# Altium schematic sheet HeartLED.SchDoc
size 889 x 381 mm; SheetNumber: 1; SheetTotal: 1
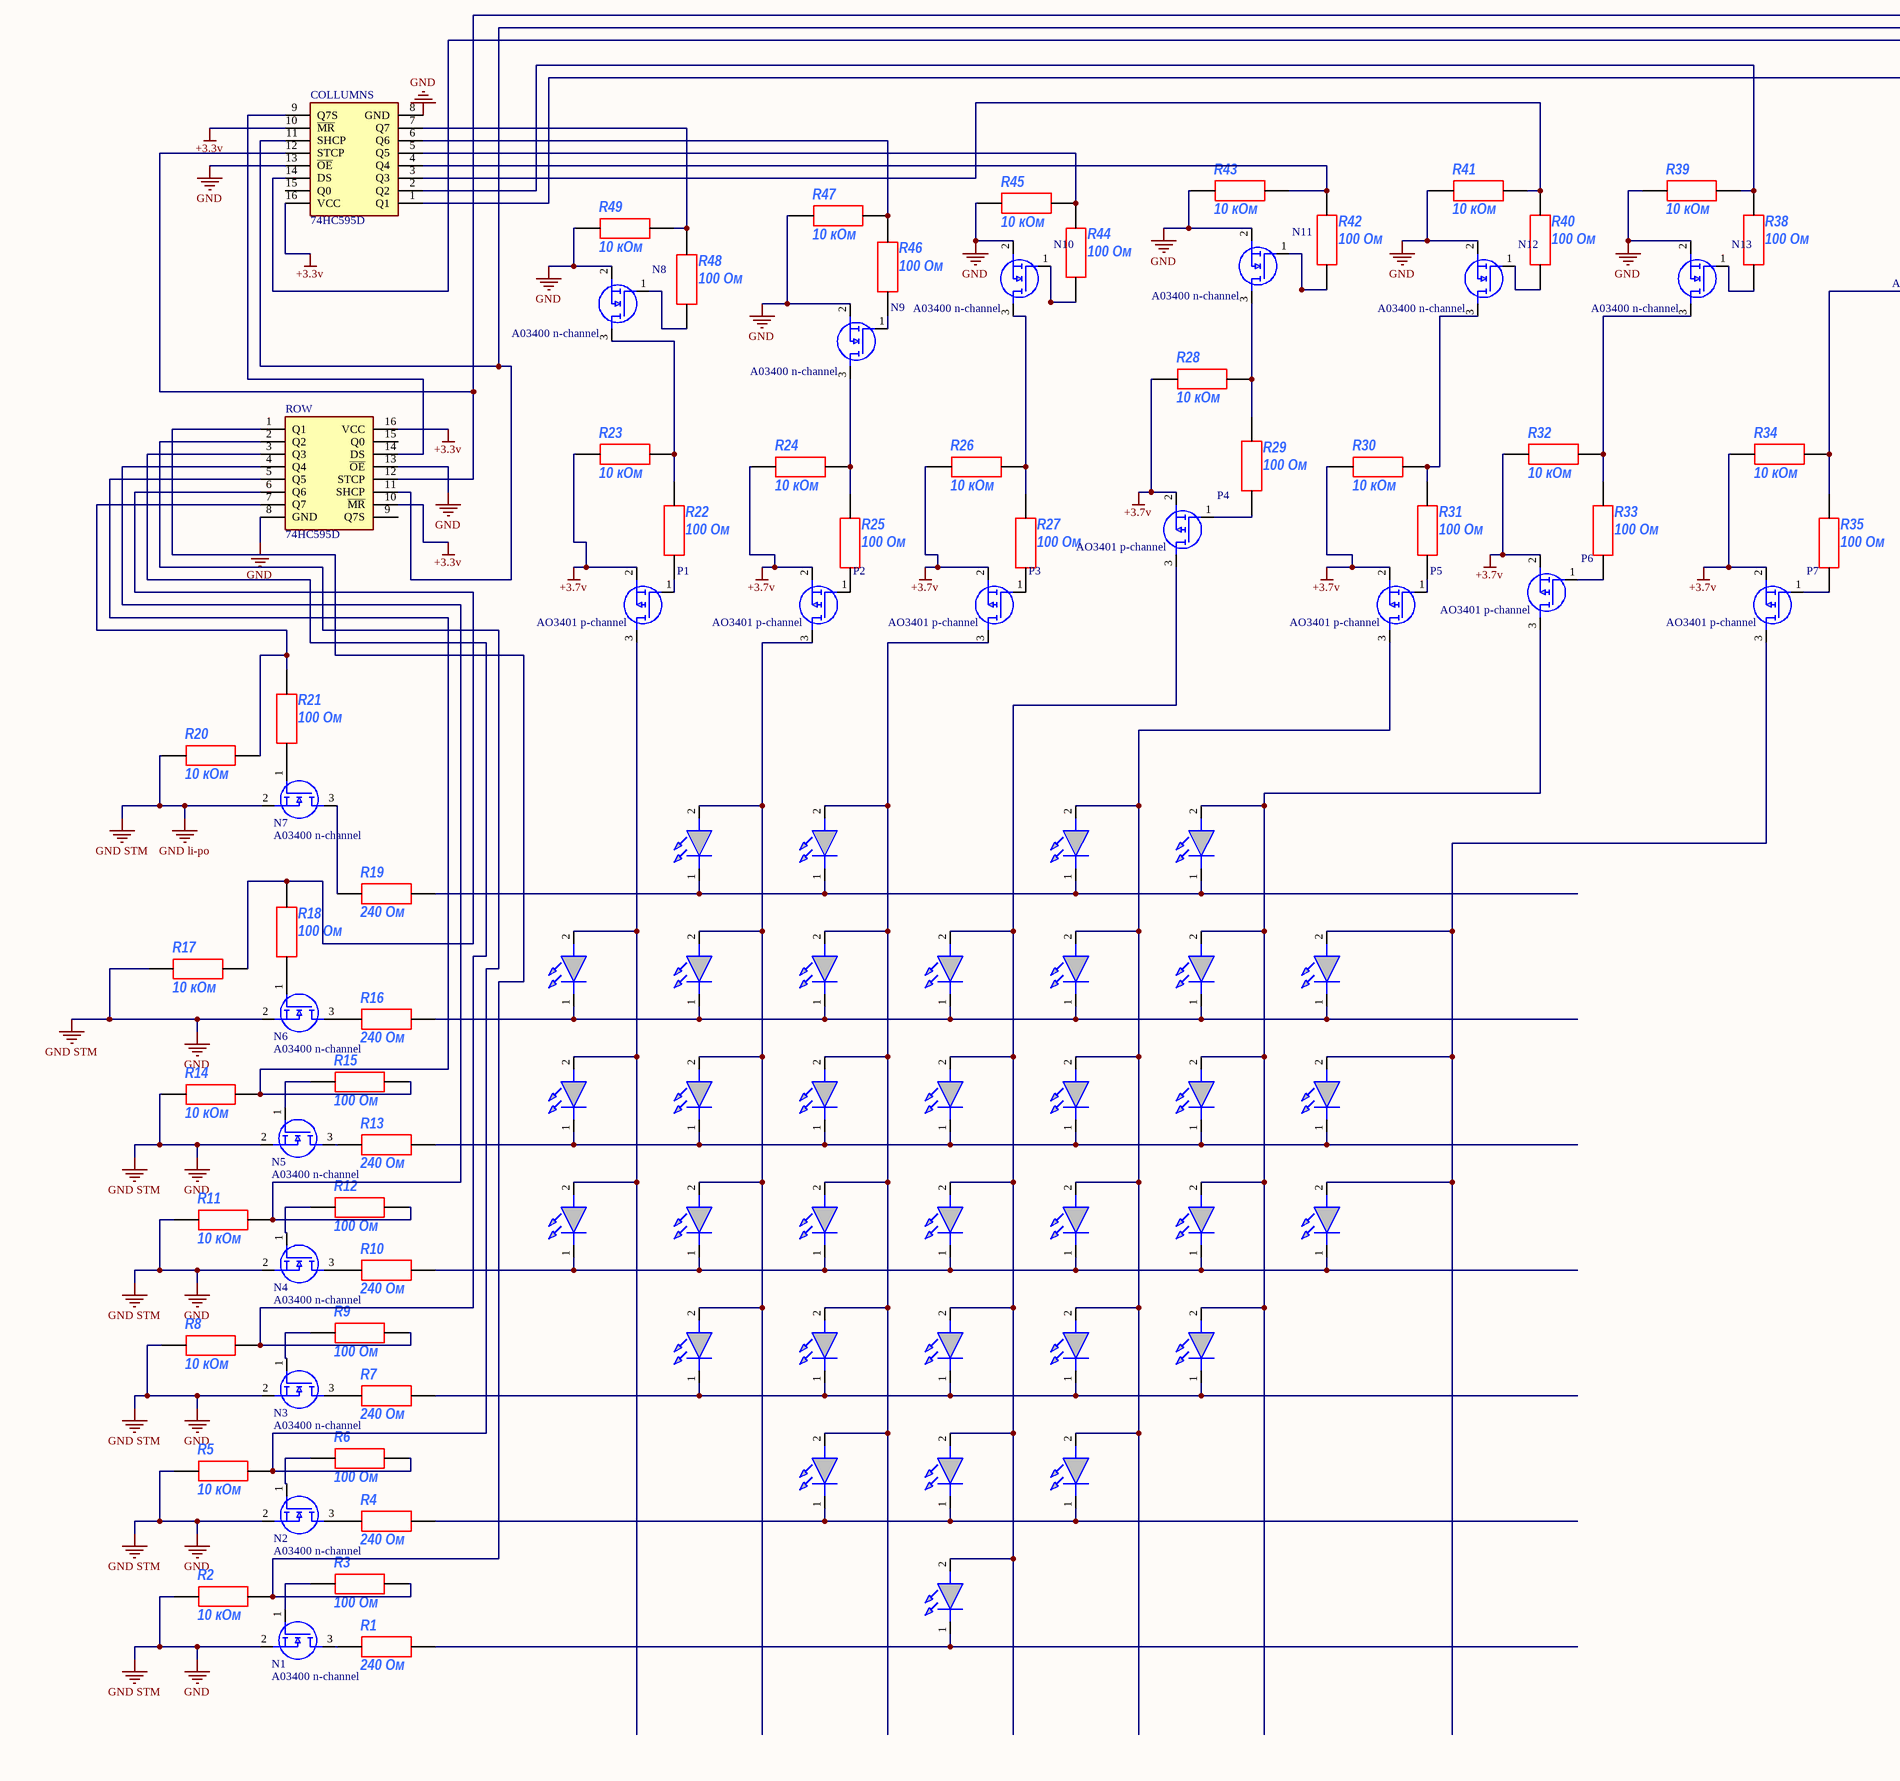
[diagram p0: HeartLED.SchDoc, left]
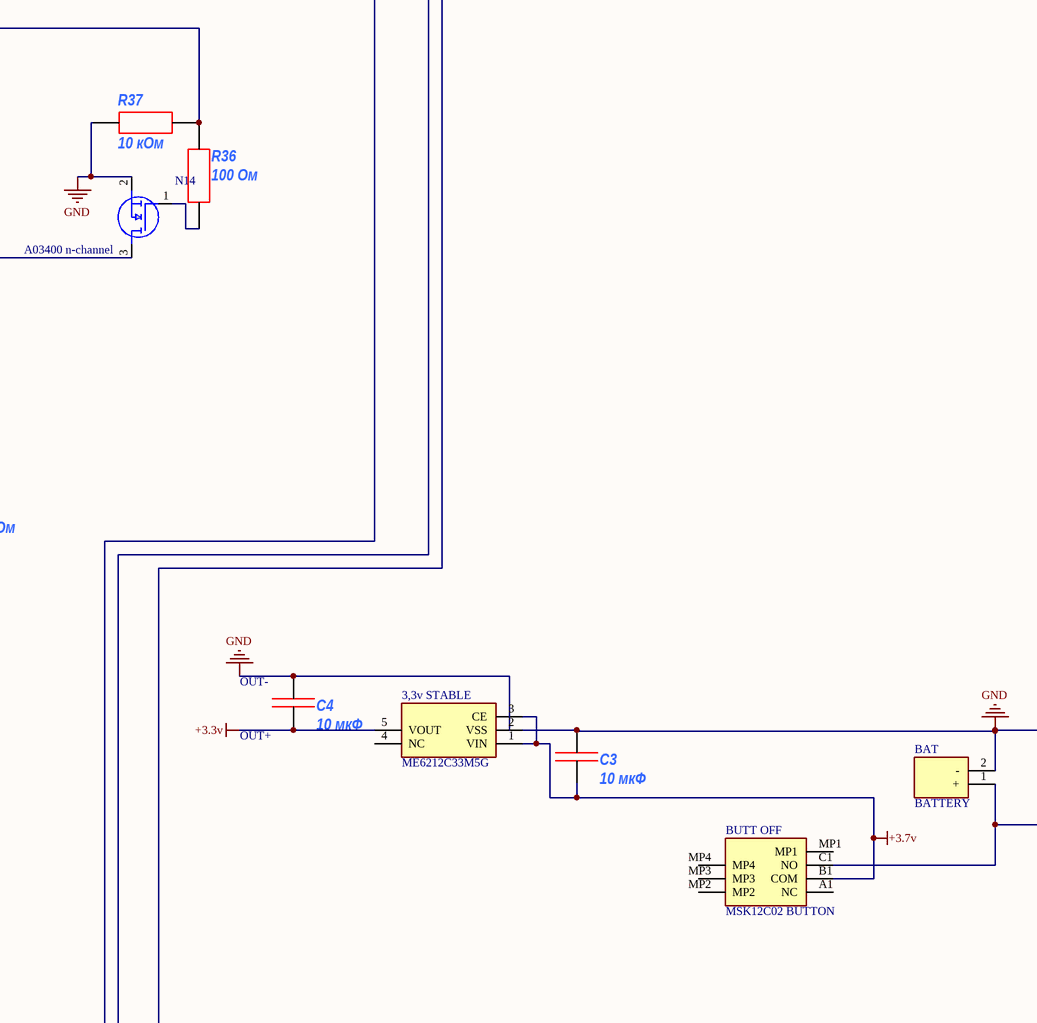
[diagram p1: HeartLED.SchDoc, middle]
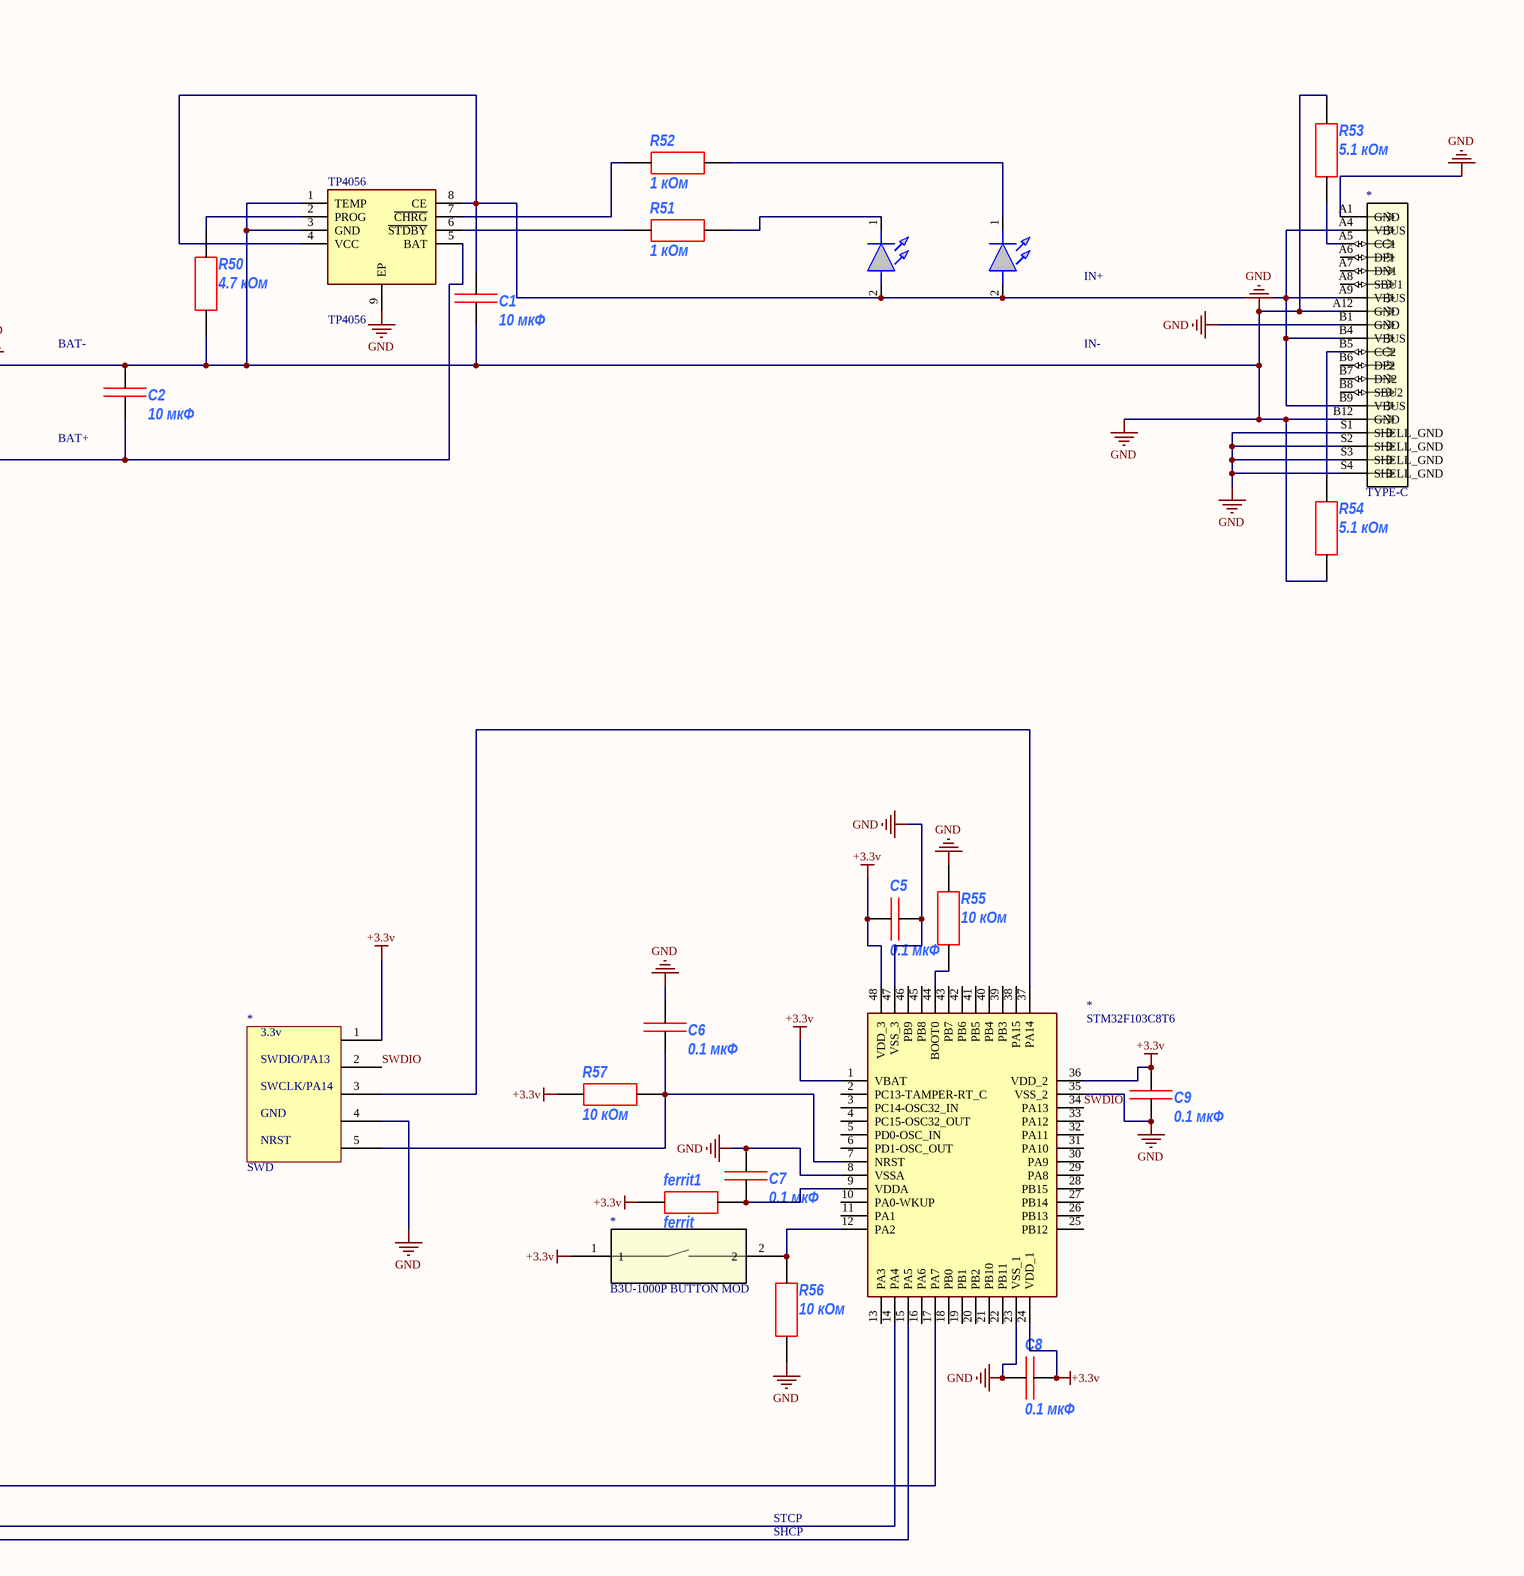
[diagram p2: HeartLED.SchDoc, right]

## Parts
(Parts that share a designator on the sheet are numbered #1, #2 ... from top to bottom, then left to right.)
3,3v_STABLE  ME6212C33M5G  [ME6212C33M5G/3.3]
*#1  TYPE-C  [USB-C]
*#2  SWD  [SWD]
*#3  STM32F103C8T6  [STM32F103C8T6]
*#4  B3U-1000P BUTTON MOD  [B3U-1000P BUTTON MOD]
BAT  BATTERY  [BATTERY]
BUTT_OFF  MSK12C02 BUTTON  [MSK12C02 BUTTON]
C1  10 мкФ  [C1206]
C2  10 мкФ  [C1206]
C3  10 мкФ  [C1206]
C4  10 мкФ  [C1206]
C5  0.1 мкФ  [C0402]
C6  0.1 мкФ  [C0402]
C7  0.1 мкФ  [C0402]
C8  0.1 мкФ  [C0402]
C9  0.1 мкФ  [C0402]
COLLUMNS  74HC595D  [74HC595D]
ferrit1  ferrit  [R0805]
LED1  LED_RED  [LED_RED]  (value not drawn)
LED2  LED_RED  [LED_RED]  (value not drawn)
LED3  LED_RED  [LED_RED]  (value not drawn)
LED4  LED_RED  [LED_RED]  (value not drawn)
LED5  LED_RED  [LED_RED]  (value not drawn)
LED6  LED_RED  [LED_RED]  (value not drawn)
LED7  LED_RED  [LED_RED]  (value not drawn)
LED8  LED_RED  [LED_RED]  (value not drawn)
LED9  LED_RED  [LED_RED]  (value not drawn)
LED10  LED_RED  [LED_RED]  (value not drawn)
LED11  LED_RED  [LED_RED]  (value not drawn)
LED12  LED_RED  [LED_RED]  (value not drawn)
LED13  LED_RED  [LED_RED]  (value not drawn)
LED14  LED_RED  [LED_RED]  (value not drawn)
LED15  LED_RED  [LED_RED]  (value not drawn)
LED16  LED_RED  [LED_RED]  (value not drawn)
LED17  LED_RED  [LED_RED]  (value not drawn)
LED18  LED_RED  [LED_RED]  (value not drawn)
LED19  LED_RED  [LED_RED]  (value not drawn)
LED20  LED_RED  [LED_RED]  (value not drawn)
LED21  LED_RED  [LED_RED]  (value not drawn)
LED22  LED_RED  [LED_RED]  (value not drawn)
LED23  LED_RED  [LED_RED]  (value not drawn)
LED24  LED_RED  [LED_RED]  (value not drawn)
LED25  LED_RED  [LED_RED]  (value not drawn)
LED26  LED_RED  [LED_RED]  (value not drawn)
LED27  LED_RED  [LED_RED]  (value not drawn)
LED28  LED_RED  [LED_RED]  (value not drawn)
LED29  LED_RED  [LED_RED]  (value not drawn)
LED30  LED_RED  [LED_RED]  (value not drawn)
LED31  LED_RED  [LED_RED]  (value not drawn)
LED32  LED_RED  [LED_RED]  (value not drawn)
LED33  LED_RED  [LED_RED]  (value not drawn)
LED34  LED_RED  [LED_RED]  (value not drawn)
LED35  LED_RED  [LED_RED]  (value not drawn)
LED36  LED_RED  [LED_RED]  (value not drawn)
N1  A03400 n-channel  [A03400]
N2  A03400 n-channel  [A03400]
N3  A03400 n-channel  [A03400]
N4  A03400 n-channel  [A03400]
N5  A03400 n-channel  [A03400]
N6  A03400 n-channel  [A03400]
N7  A03400 n-channel  [A03400]
N8  A03400 n-channel  [A03400]
N9  A03400 n-channel  [A03400]
N10  A03400 n-channel  [A03400]
N11  A03400 n-channel  [A03400]
N12  A03400 n-channel  [A03400]
N13  A03400 n-channel  [A03400]
N14  A03400 n-channel  [A03400]
P1  AO3401 p-channel  [AO3401]
P2  AO3401 p-channel  [AO3401]
P3  AO3401 p-channel  [AO3401]
P4  AO3401 p-channel  [AO3401]
P5  AO3401 p-channel  [AO3401]
P6  AO3401 p-channel  [AO3401]
P7  AO3401 p-channel  [AO3401]
R1  240 Ом  [R0603]
R2  10 кОм  [R0603]
R3  100 Ом  [R0603]
R4  240 Ом  [R0603]
R5  10 кОм  [R0603]
R6  100 Ом  [R0603]
R7  240 Ом  [R0603]
R8  10 кОм  [R0603]
R9  100 Ом  [R0603]
R10  240 Ом  [R0603]
R11  10 кОм  [R0603]
R12  100 Ом  [R0603]
R13  240 Ом  [R0603]
R14  10 кОм  [R0603]
R15  100 Ом  [R0603]
R16  240 Ом  [R0603]
R17  10 кОм  [R0603]
R18  100 Ом  [R0603]
R19  240 Ом  [R0603]
R20  10 кОм  [R0603]
R21  100 Ом  [R0603]
R22  100 Ом  [R0603]
R23  10 кОм  [R0603]
R24  10 кОм  [R0603]
R25  100 Ом  [R0603]
R26  10 кОм  [R0603]
R27  100 Ом  [R0603]
R28  10 кОм  [R0603]
R29  100 Ом  [R0603]
R30  10 кОм  [R0603]
R31  100 Ом  [R0603]
R32  10 кОм  [R0603]
R33  100 Ом  [R0603]
R34  10 кОм  [R0603]
R35  100 Ом  [R0603]
R36  100 Ом  [R0603]
R37  10 кОм  [R0603]
R38  100 Ом  [R0603]
R39  10 кОм  [R0603]
R40  100 Ом  [R0603]
R41  10 кОм  [R0603]
R42  100 Ом  [R0603]
R43  10 кОм  [R0603]
R44  100 Ом  [R0603]
R45  10 кОм  [R0603]
R46  100 Ом  [R0603]
R47  10 кОм  [R0603]
R48  100 Ом  [R0603]
R49  10 кОм  [R0603]
R50  4.7 кОм  [R0805]
R51  1 кОм  [R0805]
R52  1 кОм  [R0805]
R53  5.1 кОм  [R0603]
R54  5.1 кОм  [R0603]
R55  10 кОм  [R0603]
R56  10 кОм  [R0603]
R57  10 кОм  [R0603]
ROW  74HC595D  [74HC595D]
TP4056  TP4056  [TP4056]

## Nets
+3.3v: 3,3v_STABLE.5(VOUT) *#2.1 *#3.1(VBAT) *#3.24(VDD_1) *#3.36(VDD_2) *#3.48(VDD_3) *#4.1 C4.2 C5.1 C8.2 C9.2 COLLUMNS.10(~{MR}) COLLUMNS.16(VCC) ferrit1.1 R57.1 ROW.10(~{MR}) ROW.16(VCC)
+3.7v: 3,3v_STABLE.1(VIN) 3,3v_STABLE.3(CE) BUTT_OFF.B1(COM) C3.2 P1.2(S) P2.2(S) P3.2(S) P4.2(S) P5.2(S) P6.2(S) P7.2(S) R23.1 R24.1 R26.1 R28.1 R30.1 R32.1 R34.1
GND: 3,3v_STABLE.2(VSS) *#1.A1(GND) *#1.A12(GND) *#1.B1(GND) *#1.B12(GND) *#1.S1(SHELL_GND) *#1.S2(SHELL_GND) *#1.S3(SHELL_GND) *#1.S4(SHELL_GND) *#2.4 *#3.8(VSSA) *#3.23(VSS_1) *#3.35(VSS_2) *#3.47(VSS_3) BAT.2(-) C1.1 C2.1 C3.1 C4.1 C5.2 C6.2 C7.2 C8.1 C9.1 COLLUMNS.8(GND) COLLUMNS.13(~{OE}) N1.2(S) N2.2(S) N3.2(S) N4.2(S) N5.2(S) N6.2(S) N7.2(S) N8.2(S) N9.2(S) N10.2(S) N11.2(S) N12.2(S) N13.2(S) N14.2(S) R2.1 R5.1 R8.1 R11.1 R14.1 R17.1 R20.1 R37.1 R39.1 R41.1 R43.1 R45.1 R47.1 R49.1 R50.2 R53.2 R54.1 R55.1 R56.1 ROW.8(GND) ROW.13(~{OE}) TP4056.1(TEMP) TP4056.3(GND) TP4056.9(EP)  [also labelled GND li-po, GND STM]
SWDIO: *#2.2 *#3.34(PA13)
Net*#1_A4: *#1.A4(VBUS) *#1.A9(VBUS) *#1.B4(VBUS) *#1.B9(VBUS) C1.2 LED35.2(A) LED36.2(A) TP4056.4(VCC) TP4056.8(CE)
Net*#1_A5: *#1.A5(CC1) R53.1
Net*#1_B5: *#1.B5(CC2) R54.2
Net*#2_3: *#2.3 *#3.37(PA14)
Net*#2_5: *#2.5 *#3.7(NRST) C6.1 R57.2
Net*#3_9: *#3.9(VDDA) C7.1 ferrit1.2
Net*#3_12: *#3.12(PA2) *#4.2 R56.2
Net*#3_14: *#3.14(PA4) COLLUMNS.12(STCP) ROW.12(STCP)
Net*#3_15: *#3.15(PA5) COLLUMNS.11(SHCP) ROW.11(SHCP)
Net*#3_17: *#3.17(PA7) COLLUMNS.14(DS)
Net*#3_44: *#3.44(BOOT0) R55.2
NetBAT_1: BAT.1(+) BUTT_OFF.C1(NO) C2.2 TP4056.5(BAT)
NetCOLLUMNS_1: COLLUMNS.1(Q1) R36.2 R37.2
NetCOLLUMNS_2: COLLUMNS.2(Q2) R38.2 R39.2
NetCOLLUMNS_3: COLLUMNS.3(Q3) R40.2 R41.2
NetCOLLUMNS_4: COLLUMNS.4(Q4) R42.2 R43.2
NetCOLLUMNS_5: COLLUMNS.5(Q5) R44.2 R45.2
NetCOLLUMNS_6: COLLUMNS.6(Q6) R46.2 R47.2
NetCOLLUMNS_7: COLLUMNS.7(Q7) R48.2 R49.2
NetCOLLUMNS_9: COLLUMNS.9(Q7S) ROW.14(DS)
NetLED1_1: LED1.1(K) LED2.1(K) LED3.1(K) LED4.1(K) R19.2
NetLED1_2: LED1.2(A) LED6.2(A) LED13.2(A) LED20.2(A) LED26.2(A) P2.3(D)
NetLED2_2: LED2.2(A) LED7.2(A) LED14.2(A) LED21.2(A) LED27.2(A) LED31.2(A) P3.3(D)
NetLED3_2: LED3.2(A) LED9.2(A) LED16.2(A) LED23.2(A) LED29.2(A) LED33.2(A) P5.3(D)
NetLED4_2: LED4.2(A) LED10.2(A) LED17.2(A) LED24.2(A) LED30.2(A) P6.3(D)
NetLED5_1: LED5.1(K) LED6.1(K) LED7.1(K) LED8.1(K) LED9.1(K) LED10.1(K) LED11.1(K) R16.2
NetLED5_2: LED5.2(A) LED12.2(A) LED19.2(A) P1.3(D)
NetLED8_2: LED8.2(A) LED15.2(A) LED22.2(A) LED28.2(A) LED32.2(A) LED34.2(A) P4.3(D)
NetLED11_2: LED11.2(A) LED18.2(A) LED25.2(A) P7.3(D)
NetLED12_1: LED12.1(K) LED13.1(K) LED14.1(K) LED15.1(K) LED16.1(K) LED17.1(K) LED18.1(K) R13.2
NetLED19_1: LED19.1(K) LED20.1(K) LED21.1(K) LED22.1(K) LED23.1(K) LED24.1(K) LED25.1(K) R10.2
NetLED26_1: LED26.1(K) LED27.1(K) LED28.1(K) LED29.1(K) LED30.1(K) R7.2
NetLED31_1: LED31.1(K) LED32.1(K) LED33.1(K) R4.2
NetLED34_1: LED34.1(K) R1.2
NetLED35_1: LED35.1(K) R51.1
NetLED36_1: LED36.1(K) R52.1
NetN1_1: N1.1(G) R3.2
NetN1_3: N1.3(D) R1.1
NetN2_1: N2.1(G) R6.2
NetN2_3: N2.3(D) R4.1
NetN3_1: N3.1(G) R9.2
NetN3_3: N3.3(D) R7.1
NetN4_1: N4.1(G) R12.2
NetN4_3: N4.3(D) R10.1
NetN5_1: N5.1(G) R15.2
NetN5_3: N5.3(D) R13.1
NetN6_1: N6.1(G) R18.1
NetN6_3: N6.3(D) R16.1
NetN7_1: N7.1(G) R21.2
NetN7_3: N7.3(D) R19.1
NetN8_1: N8.1(G) R48.1
NetN8_3: N8.3(D) R22.2 R23.2
NetN9_1: N9.1(G) R46.1
NetN9_3: N9.3(D) R24.2 R25.2
NetN10_1: N10.1(G) R44.1
NetN10_3: N10.3(D) R26.2 R27.2
NetN11_1: N11.1(G) R42.1
NetN11_3: N11.3(D) R28.2 R29.2
NetN12_1: N12.1(G) R40.1
NetN12_3: N12.3(D) R30.2 R31.2
NetN13_1: N13.1(G) R38.1
NetN13_3: N13.3(D) R32.2 R33.2
NetN14_1: N14.1(G) R36.1
NetN14_3: N14.3(D) R34.2 R35.2
NetP1_1: P1.1(G) R22.1
NetP2_1: P2.1(G) R25.1
NetP3_1: P3.1(G) R27.1
NetP4_1: P4.1(G) R29.1
NetP5_1: P5.1(G) R31.1
NetP6_1: P6.1(G) R33.1
NetP7_1: P7.1(G) R35.1
NetR2_2: R2.2 R3.1 ROW.1(Q1)
NetR5_2: R5.2 R6.1 ROW.2(Q2)
NetR8_2: R8.2 R9.1 ROW.3(Q3)
NetR11_2: R11.2 R12.1 ROW.4(Q4)
NetR14_2: R14.2 R15.1 ROW.5(Q5)
NetR17_2: R17.2 R18.2 ROW.6(Q6)
NetR20_2: R20.2 R21.1 ROW.7(Q7)
NetR50_1: R50.1 TP4056.2(PROG)
NetR51_2: R51.2 TP4056.6(~{STDBY})
NetR52_2: R52.2 TP4056.7(~{CHRG})

Not connected (* = marked no-connect by the designer): 3,3v_STABLE 4(NC); *#1 A6(DP1) A7(DN1) A8(SBU1) B6(DP2) B7(DN2) B8(SBU2); *#3 2(PC13-TAMPER-RT_C) 3(PC14-OSC32_IN) 4(PC15-OSC32_OUT) 5(PD0-OSC_IN) 6(PD1-OSC_OUT) 10(PA0-WKUP) 11(PA1) 13(PA3) 16(PA6) 18(PB0) 19(PB1) 20(PB2) 21(PB10) 22(PB11) 25(PB12) 26(PB13) 27(PB14) 28(PB15) 29(PA8) 30(PA9) 31(PA10) 32(PA11) 33(PA12) 38(PA15) 39(PB3) 40(PB4) 41(PB5) 42(PB6) 43(PB7) 45(PB8) 46(PB9); BUTT_OFF A1(NC) MP1 MP2 MP3 MP4; COLLUMNS 15(Q0); ROW 9(Q7S) 15(Q0)

## Notes on the sheet
- (near C4) OUT-
- IN+
- (near C4) OUT+
- BAT-
- IN-
- BAT+
- STCP
- SHCP
- (in symbol SWD) 3.3v; SWDIO/PA13; SWCLK/PA14; GND; NRST

## Library data of the parts
C1-C4 = 10 мкФ 1% X7R 10В 1206: 1206 X5R; Tolerance: 1%; Type: X7R; ID: CCS00422; Корпус: 1206; Power/Voltage: 10В; PrimaryValue: 10; Part Number: 10 мкФ 1% X7R 10В 1206; Manufacturer: *; ManufacturerPartNumber: *; Rem: *; Value: 10 мкФ; Примечание: *; GroupSpecification: *; UnitsValue: мкФ
C5-C9 = 0.1 мкФ 10% X7R 16В 0402: 0402; Tolerance: 10%; Type: X7R; ID: CCS00423; Power/Voltage: 16В; PrimaryValue: 0.1; Part Number: 0.1 мкФ 10% X7R 16В 0402; Manufacturer: *; ManufacturerPartNumber: *; Rem: *; Value: 0.1 мкФ; Корпус: 0402; Примечание: *; GroupSpecification: *; UnitsValue: мкФ
ferrit1 = 1 Ом 1% 0.125 Вт 0805: 0805; ID: RS00193; Tolerance: 1%; Value: 1 Ом; UnitsValue: Ом; PrimaryValue: 1; Part Number: 1 Ом 1% 0.125 Вт 0805; Manufacturer: *; ManufacturerPartNumber: *; Rem: *; TKE: *; TU/GOST: *; Type: *; Корпус: 0805; Примечание: *; Power/Voltage: 0.125 Вт; GroupSpecification: *
R1 R4 R7 R10 R13 R16 R19 = 160 Ом 1% 0.063 Вт 0603: 0603; ID: RS00150; Tolerance: 1%; Value: 160 Ом; PrimaryValue: 160; Part Number: 160 Ом 1% 0.063 Вт 0603; Manufacturer: *; ManufacturerPartNumber: *; Rem: *; TKE: *; TU/GOST: *; Type: *; Корпус: 0603; Примечание: *; Power/Voltage: 0.063 Вт; GroupSpecification: *; UnitsValue: Ом
R2 R5 R8 R11 R14 R17 R20 R23 R24 R26 R28 R30 R32 R34 R37 R39 R41 R43 R45 R47 R49 R55-R57 = 10 кОм 1% 0.063 Вт 0603: 0603; ID: RS00097; Tolerance: 1%; PrimaryValue: 10; Part Number: 10 кОм 1% 0.063 Вт 0603; Manufacturer: *; ManufacturerPartNumber: *; Rem: *; TKE: *; TU/GOST: *; Type: *; Value: 10 кОм; Корпус: 0603; Примечание: *; Power/Voltage: 0.063 Вт; GroupSpecification: *; UnitsValue: кОм
R3 R6 R9 R12 R15 R18 R21 R22 R25 R27 R29 R31 R33 R35 R36 R38 R40 R42 R44 R46 R48 = 100 Ом 1% 0.063 Вт 0603: 0603; ID: RS00145; Tolerance: 1%; PrimaryValue: 100; Part Number: 100 Ом 1% 0.063 Вт 0603; Manufacturer: *; ManufacturerPartNumber: *; Rem: *; TKE: *; TU/GOST: *; Type: *; Value: 100 Ом; Корпус: 0603; Примечание: *; Power/Voltage: 0.063 Вт; GroupSpecification: *; UnitsValue: Ом
R50 = 4.7 кОм 1% 0.125 Вт 0805: 0805; ID: RS00233; Tolerance: 1%; PrimaryValue: 4.7; Part Number: 4.7 кОм 1% 0.125 Вт 0805; Manufacturer: *; ManufacturerPartNumber: *; Rem: *; TKE: *; TU/GOST: *; Type: *; Value: 4.7 кОм; Корпус: 0805; Примечание: *; Power/Voltage: 0.125 Вт; GroupSpecification: *; UnitsValue: кОм
R51 R52 = 1 кОм 1% 0.125 Вт 0805: 0805; ID: RS00217; Tolerance: 1%; PrimaryValue: 1; Part Number: 1 кОм 1% 0.125 Вт 0805; Manufacturer: *; ManufacturerPartNumber: *; Rem: *; TKE: *; TU/GOST: *; Type: *; Value: 1 кОм; Корпус: 0805; Примечание: *; Power/Voltage: 0.125 Вт; GroupSpecification: *; UnitsValue: кОм
R53 R54 = 5.1 кОм 1% 0.063 Вт 0603: 1206; ID: RS00042; Tolerance: 1%; Корпус: 0603; PrimaryValue: 5.1; Part Number: 5.1 кОм 1% 0.063 Вт 0603; Manufacturer: *; ManufacturerPartNumber: *; Rem: *; TKE: *; TU/GOST: *; Type: *; Value: 5.1 кОм; Примечание: *; Power/Voltage: 0.063 Вт; GroupSpecification: *; UnitsValue: кОм